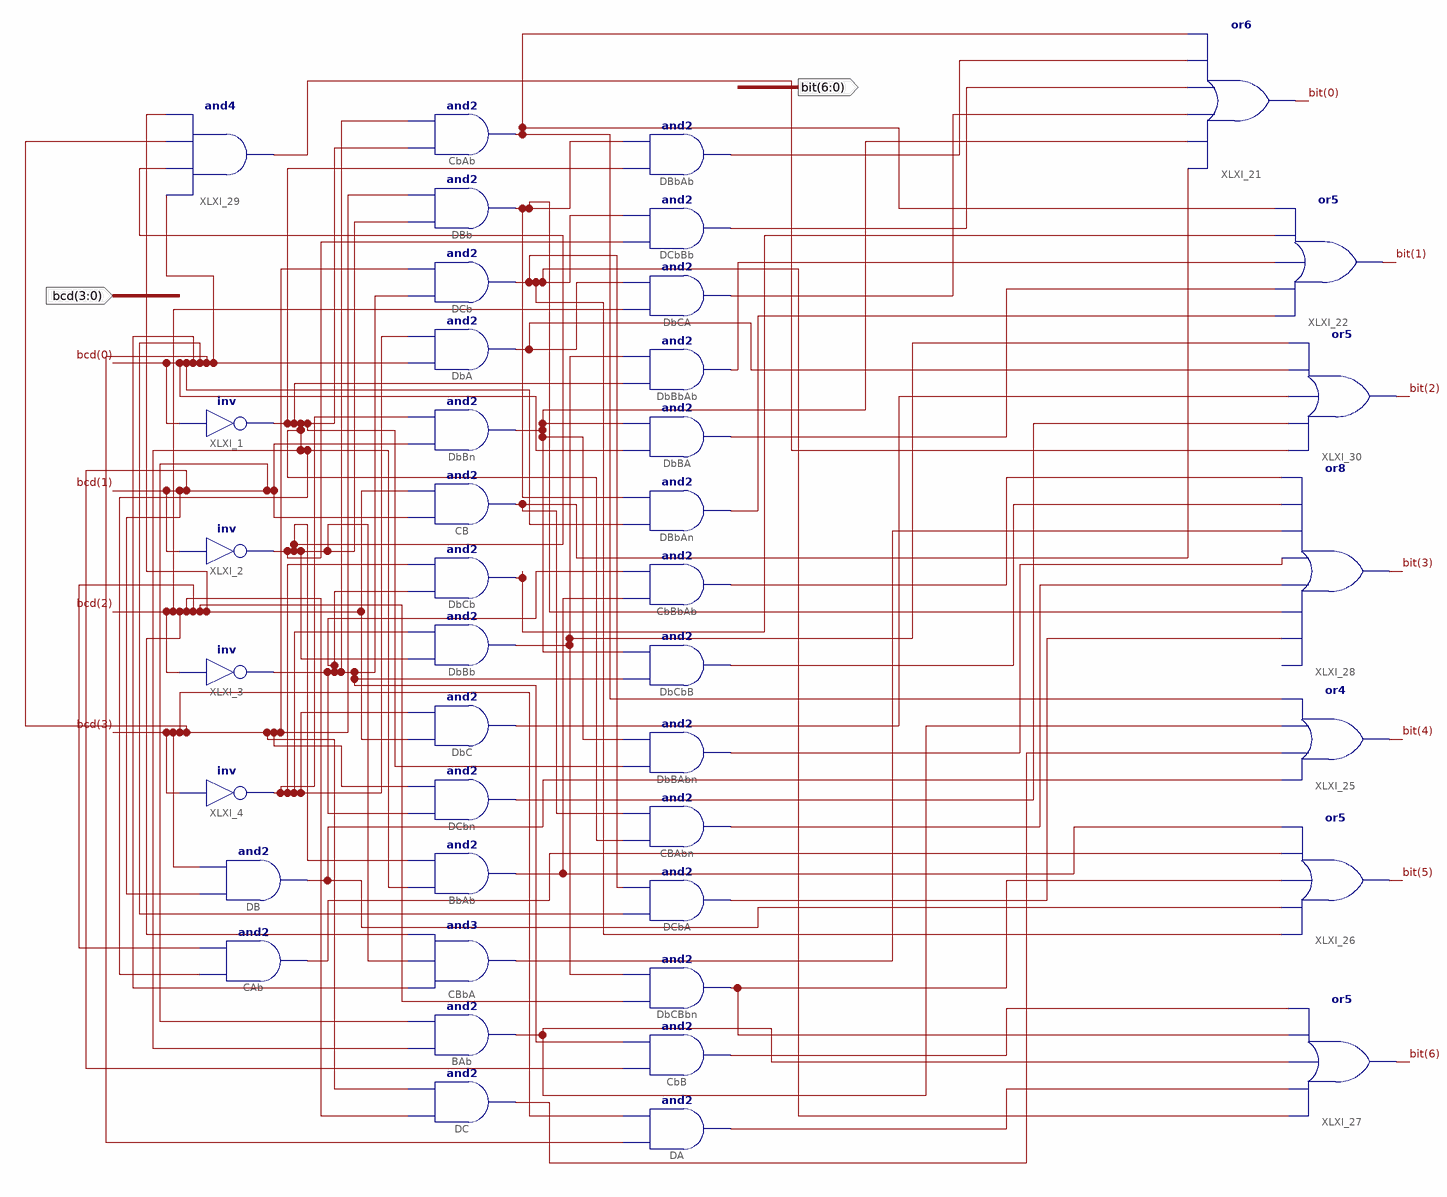
[diagram p0: schematic sheet 1]
// Xilinx ISE schematic bcdToHexDecoder.sch (spartan6) as structural Verilog: 42 symbols, 2 ports
module bcdToHexDecoder (
  input  [3:0] bcd,
  output [6:0] \bit 
);

  wire XLNX, XLXN_17, XLXN_22, XLXN_31, XLXN_33, XLXN_34, XLXN_35, XLXN_36, XLXN_73, XLXN_78, XLXN_79,
       XLXN_81, XLXN_82, XLXN_83, XLXN_84, XLXN_85, XLXN_86, XLXN_87, XLXN_89, XLXN_90, XLXN_92, XLXN_93,
       XLXN_94, XLXN_97, XLXN_98, XLXN_99, XLXN_119, XLXN_120, XLXN_121, XLXN_122, XLXN_123, XLXN_133,
       XLXN_139, XLXN_140, XLXN_141;

  not XLXI_1 (XLXN_93, bcd[0]);
  not XLXI_2 (XLXN_133, bcd[1]);
  not XLXI_3 (XLXN_81, bcd[2]);
  not XLXI_4 (XLXN_73, bcd[3]);
  or XLXI_21 (\bit [0], XLXN_119, XLNX, XLXN_123, XLXN_122, XLXN_121, XLXN_120);
  or XLXI_22 (\bit [1], XLXN_36, XLXN_34, XLXN_33, XLXN_78, XLXN_120);
  or XLXI_25 (\bit [4], XLXN_92, XLXN_90, XLXN_89, XLXN_120);
  or XLXI_26 (\bit [5], XLXN_17, XLXN_92, XLXN_98, XLXN_94, XLXN_79);
  or XLXI_27 (\bit [6], XLXN_17, XLXN_99, XLXN_89, XLXN_98, XLXN_97);
  and CbAb (XLXN_120, XLXN_93, XLXN_81);
  and DBb (XLXN_35, XLXN_133, bcd[3]);
  and DCb (XLXN_17, XLXN_81, bcd[3]);
  and DbA (XLXN_22, bcd[0], XLXN_73);
  and DbBn (XLNX, bcd[1], XLXN_73);
  and CB (XLXN_119, bcd[1], bcd[2]);
  and DbCb (XLXN_78, XLXN_81, XLXN_73);
  and DbBb (XLXN_31, XLXN_133, XLXN_73);
  and DbC (XLXN_139, bcd[2], XLXN_73);
  and DCbn (XLXN_140, XLXN_81, bcd[3]);
  and BbAb (XLXN_79, XLXN_93, XLXN_133);
  and DBbAb (XLXN_121, XLXN_93, XLXN_35);
  and DCbBb (XLXN_122, XLXN_133, XLXN_17);
  and DbCA (XLXN_123, bcd[2], XLXN_22);
  and DbBbAb (XLXN_33, XLXN_93, XLXN_31);
  and DbBA (XLXN_34, bcd[0], XLNX);
  and DBbAn (XLXN_36, bcd[0], XLXN_35);
  and CbBbAb (XLXN_82, XLXN_79, XLXN_81);
  and DbCbB (XLXN_83, XLXN_81, XLNX);
  and DbBAbn (XLXN_85, XLXN_93, XLNX);
  and CBbA (XLXN_84, bcd[0], XLXN_133, bcd[2]);
  and CBAbn (XLXN_86, XLXN_93, XLXN_119);
  and DCbA (XLXN_87, bcd[0], XLXN_17);
  and DB (XLXN_92, bcd[1], bcd[3]);
  and BAb (XLXN_89, XLXN_93, bcd[1]);
  and DC (XLXN_90, bcd[2], bcd[3]);
  and CAb (XLXN_94, XLXN_93, bcd[2]);
  and DbCBbn (XLXN_98, bcd[2], XLXN_31);
  and CbB (XLXN_97, bcd[1], XLXN_81);
  and DA (XLXN_99, bcd[0], bcd[3]);
  or XLXI_28 (\bit [3], XLXN_87, XLXN_35, XLXN_86, XLXN_85, XLXN_84, XLXN_83, XLXN_82);  // open: I0
  and XLXI_29 (XLXN_141, bcd[0], XLXN_133, bcd[3], bcd[2]);
  or XLXI_30 (\bit [2], XLXN_141, XLXN_140, XLXN_139, XLXN_22, XLXN_31);
endmodule
